# EAGLE design DUALPOWERS (EAGLE 9.6.2)
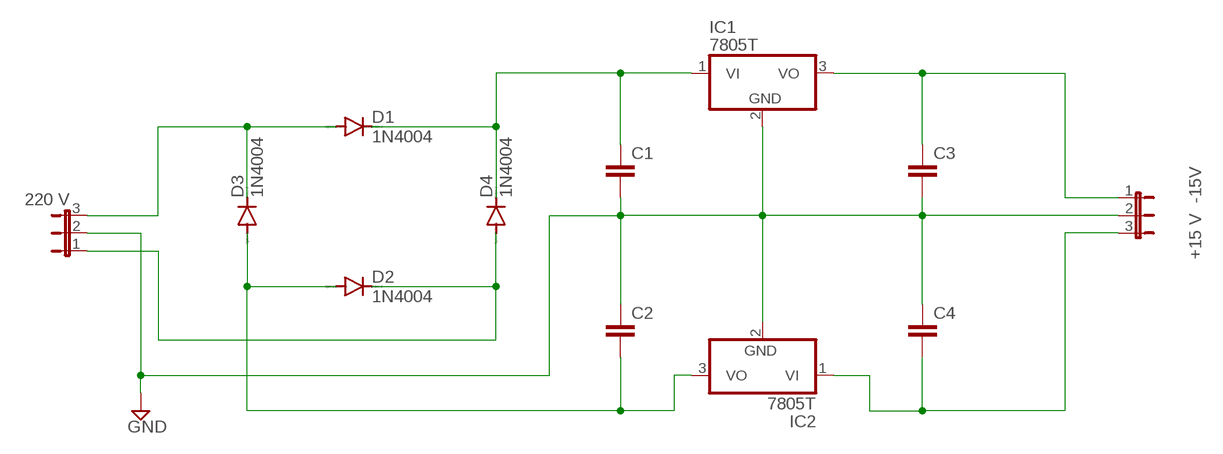
[diagram p0: schematic, sheet 1]

## Parts
-5V_GND_+5V  +15 V -15V  JP2E  [JP2]
C1  C2,5-3  [C2.5-3]
C2  C2,5-3  [C2.5-3]
C3  C2,5-3  [C2.5-3]
C4  C2,5-3  [C2.5-3]
D1  1N4004  [DO41-10]
D2  1N4004  [DO41-10]
D3  1N4004  [DO41-10]
D4  1N4004  [DO41-10]
IC1  7805T  [TO220H]
IC2  7805T  [TO220H]
JMP  220 V  JP2E  [JP2]

## Nets
GND: -5V_GND_+5V.2 C1.2 C2.1 C3.2 C4.1 IC1.2(GND) IC2.2(GND) JMP.2
N$1: D1.A D3.C JMP.3
N$2: -5V_GND_+5V.3 C4.2 IC2.1(VI)
N$3: C2.2 D2.A D3.A IC2.3(VO)
N$5: C1.1 D1.C D4.C IC1.1(VI)
N$7: -5V_GND_+5V.1 C3.1 IC1.3(VO)
N$8: D2.C D4.A JMP.1

## Library data of the parts
-5V_GND_+5V JMP = jumper:JP2E: JUMPER
C1-C4 = capacitor-wima:C: CAPACITOR naming: grid - package width
D1-D4 = diode:1N4004: DIODE general purpose rectifier, 1 A
IC1 IC2 = linear:78*: Positive VOLTAGE REGULATOR Source: http://cache.national.com/ds/LM/LM78L05.pdf http://www.fairchildsemi.com/ds/LM/LM7805.pdf

## Board
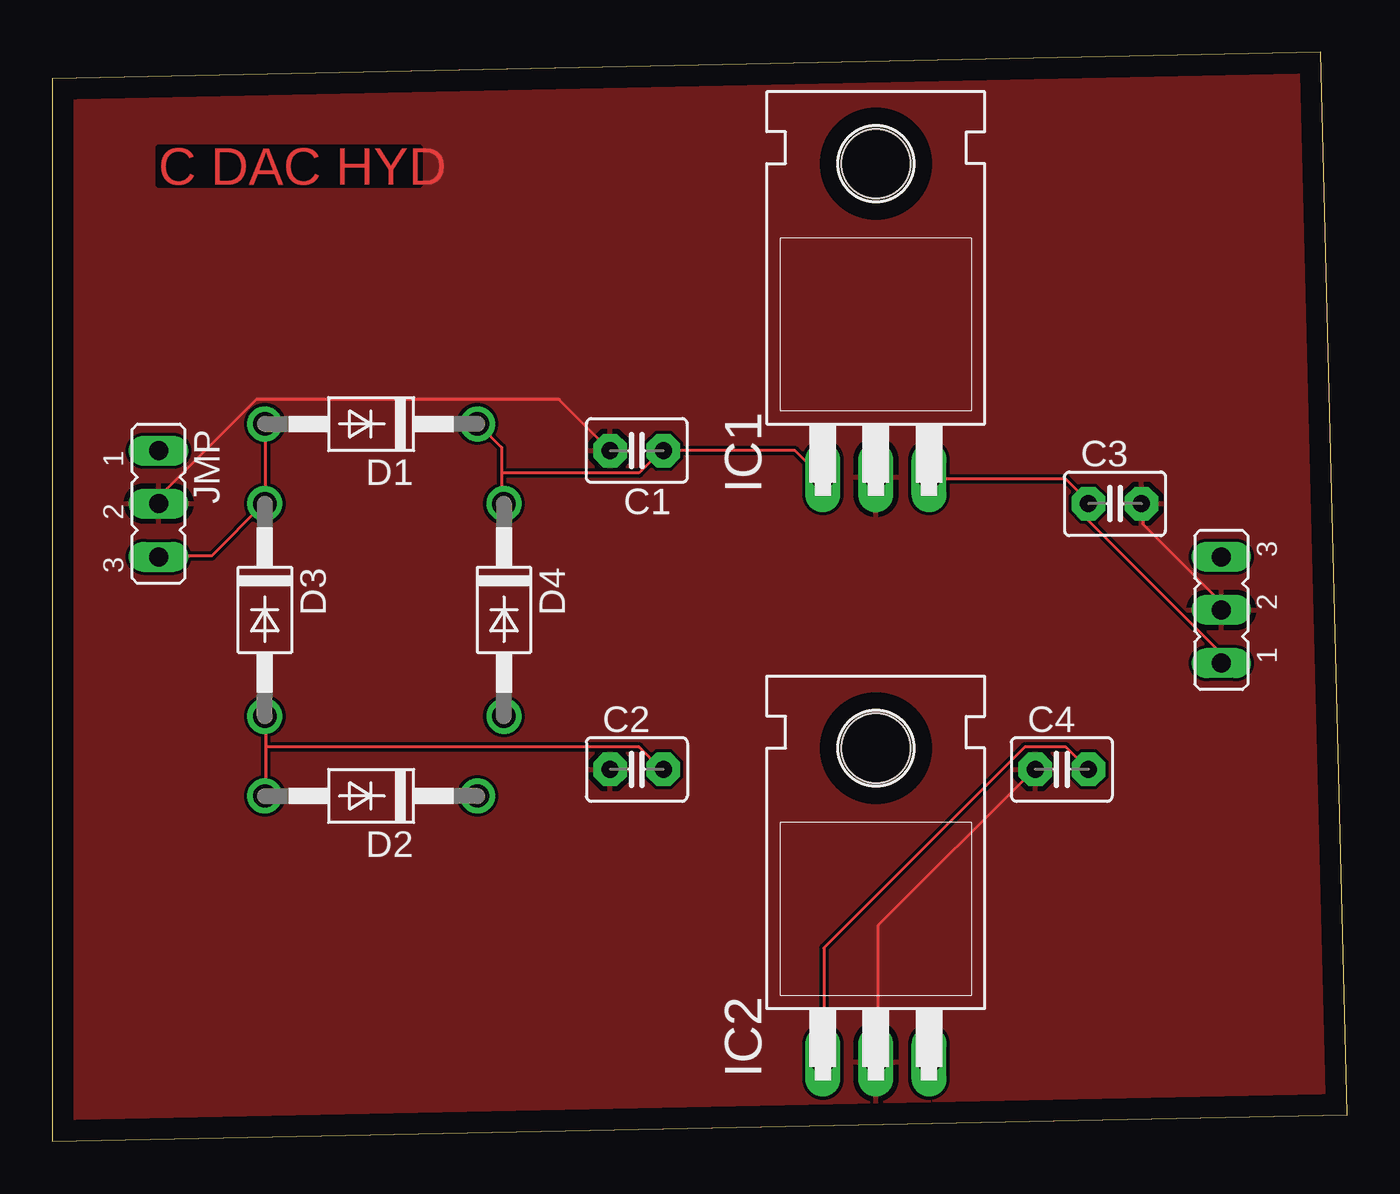
[diagram p1: board, top side]
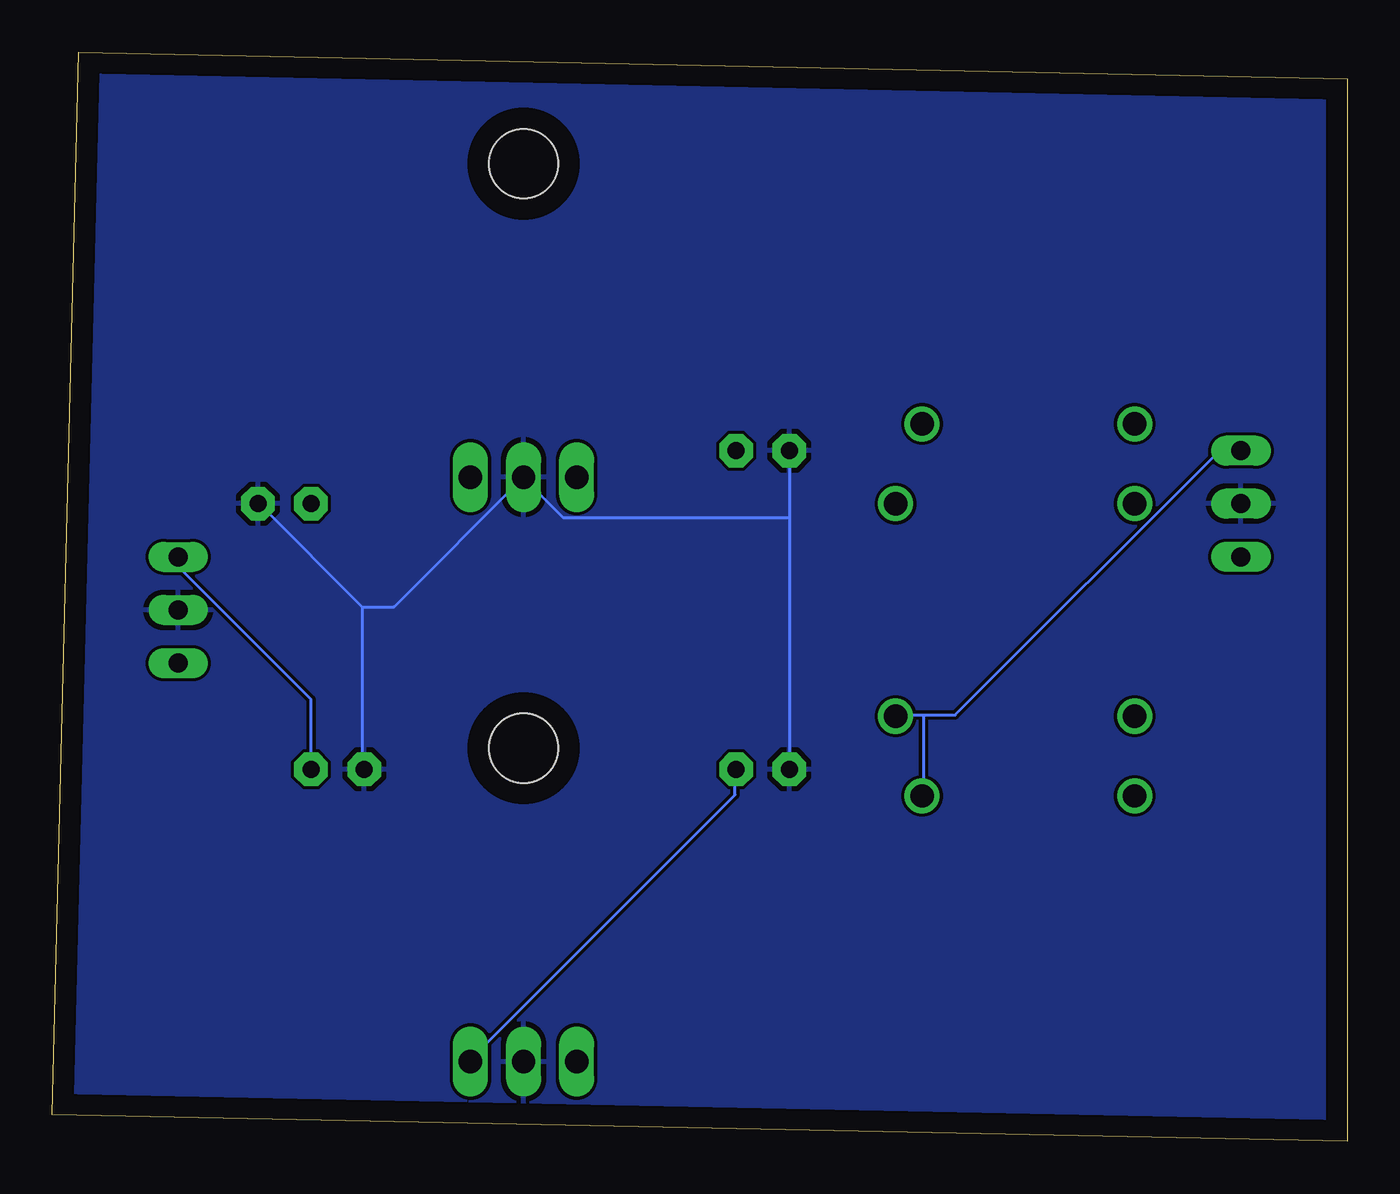
[diagram p2: board, bottom side, seen from below]

Size 61.9 x 52.06 mm. Coordinates in mm from the lower left corner, seen from the top.
Outline: 0,0 61.9,1.27 60.63,52.06 0,50.79 0,0
Copper layers (1*16): Top 0.035mm / dielectric 1.5mm / Bottom 0.035mm
Design rules "default": minimum track width 6mil, minimum drill 0.35mm, track to track 6mil, track to pad 6mil, pad to pad 6mil, via to via 6mil, smd to smd 6mil, copper to edge 40mil, drill to drill 6mil, minimum pad ring 10mil, minimum via ring 8mil, stop-mask expansion 4mil, vias tented up to drill 0mil, thermal gap 10mil

### Footprints (pad centres in the part's own frame; a part is rotated, then mirrored left to right if it is on the bottom)
JP2 = drill 0.914 long: 1 -2.54,0; 2 0,0; 3 2.54,0
C2.5-3 = drill 0.813 pad 1.6 octagon: 1 -1.27,0; 2 1.27,0
DO41-10 = drill 1.118: A 5.08,0; C -5.08,0
TO220H = drill 1.118 long: 1 -2.54,-10.16; 2 0,-10.16; 3 2.54,-10.16 | hole 3.302: 0,4.826

### Placement (x,y rotation side)
-5V_GND_+5V  55.88,25.4 90 top
C1  27.94,33.02 180 top
C2  27.94,17.78 0 top
C3  50.8,30.48 0 top
C4  48.26,17.78 0 top
D1  15.24,34.29 180 top
D2  15.24,16.51 180 top
D3  10.16,25.4 270 top
D4  21.59,25.4 270 top
IC1  39.37,41.91 0 top
IC2  39.37,13.97 0 top
JMP  5.08,30.48 270 top

### Tracks (layer width: path | path; a pad name or v marks a point on that pad's centre or on a via)
GND
  Top 0.152: C1.2 24.23,35.46 9.75,35.46 5.18,30.89 5.18,30.58 JMP.2 | -5V_GND_+5V.2 55.78,25.4 55.78,25.86 52.12,29.52 52.12,30.43 C3.2 | IC2.2 39.47,3.91 39.47,10.31 46.94,17.78 C4.1
  Bottom 0.152: C1.2 26.67,29.82 | 26.67,29.82 C2.1 | 47.09,25.55 47.09,17.78 C4.1 | 47.09,25.55 51.97,30.43 C3.2 | 47.09,25.55 45.57,25.55 IC1.2 39.32,31.65 37.49,29.82 26.67,29.82
  pour Top: -1.27,52.07 64.77,52.07 64.77,0 64.77,-3.81 -2.54,-3.81 -2.54,52.07
  pour Bottom: -3.81,54.61 69.85,54.61 69.85,-7.62 69.85,-10.16 -8.89,-10.16 -8.89,54.61
N$1
  Top 0.152: JMP.3 5.18,27.99 7.62,27.99 10.06,30.43 D3.C 10.21,30.58 10.21,34.24 D1.A
N$2
  Top 0.152: C4.2 48.46,18.85 46.48,18.85 36.88,9.25 36.88,3.91 IC2.1
  Bottom 0.152: C4.2 49.53,21.13 55.78,27.38 55.78,27.84 -5V_GND_+5V.3
N$3
  Top 0.152: 10.21,18.85 10.21,20.22 D3.A | 10.21,18.85 10.21,16.56 D2.A | 10.21,18.85 28.04,18.85 29.11,17.78 C2.2
  Bottom 0.152: C2.2 29.26,17.78 29.26,16.56 41.91,3.91 IC2.3
N$5
  Top 0.152: 21.49,31.95 21.49,33.17 20.42,34.24 D1.C | 21.49,31.95 21.49,30.58 D4.C | IC1.1 36.73,31.8 35.51,33.02 C1.1 29.11,33.02 28.04,31.95 21.49,31.95
N$7
  Top 0.152: -5V_GND_+5V.1 55.78,22.96 55.78,23.42 49.53,29.67 C3.1 49.53,30.58 48.46,31.65 41.91,31.65 IC1.3
N$8
  Bottom 0.152: JMP.1 6.1,33.02 18.75,20.37 20.27,20.37 | 20.27,20.37 21.49,20.37 D4.A | 20.27,20.37 20.27,16.56 D2.C

### Text on the board
Top: C DAC HYD